# EAGLE design MiKro-1_0-Rev-A (EAGLE 6.4)
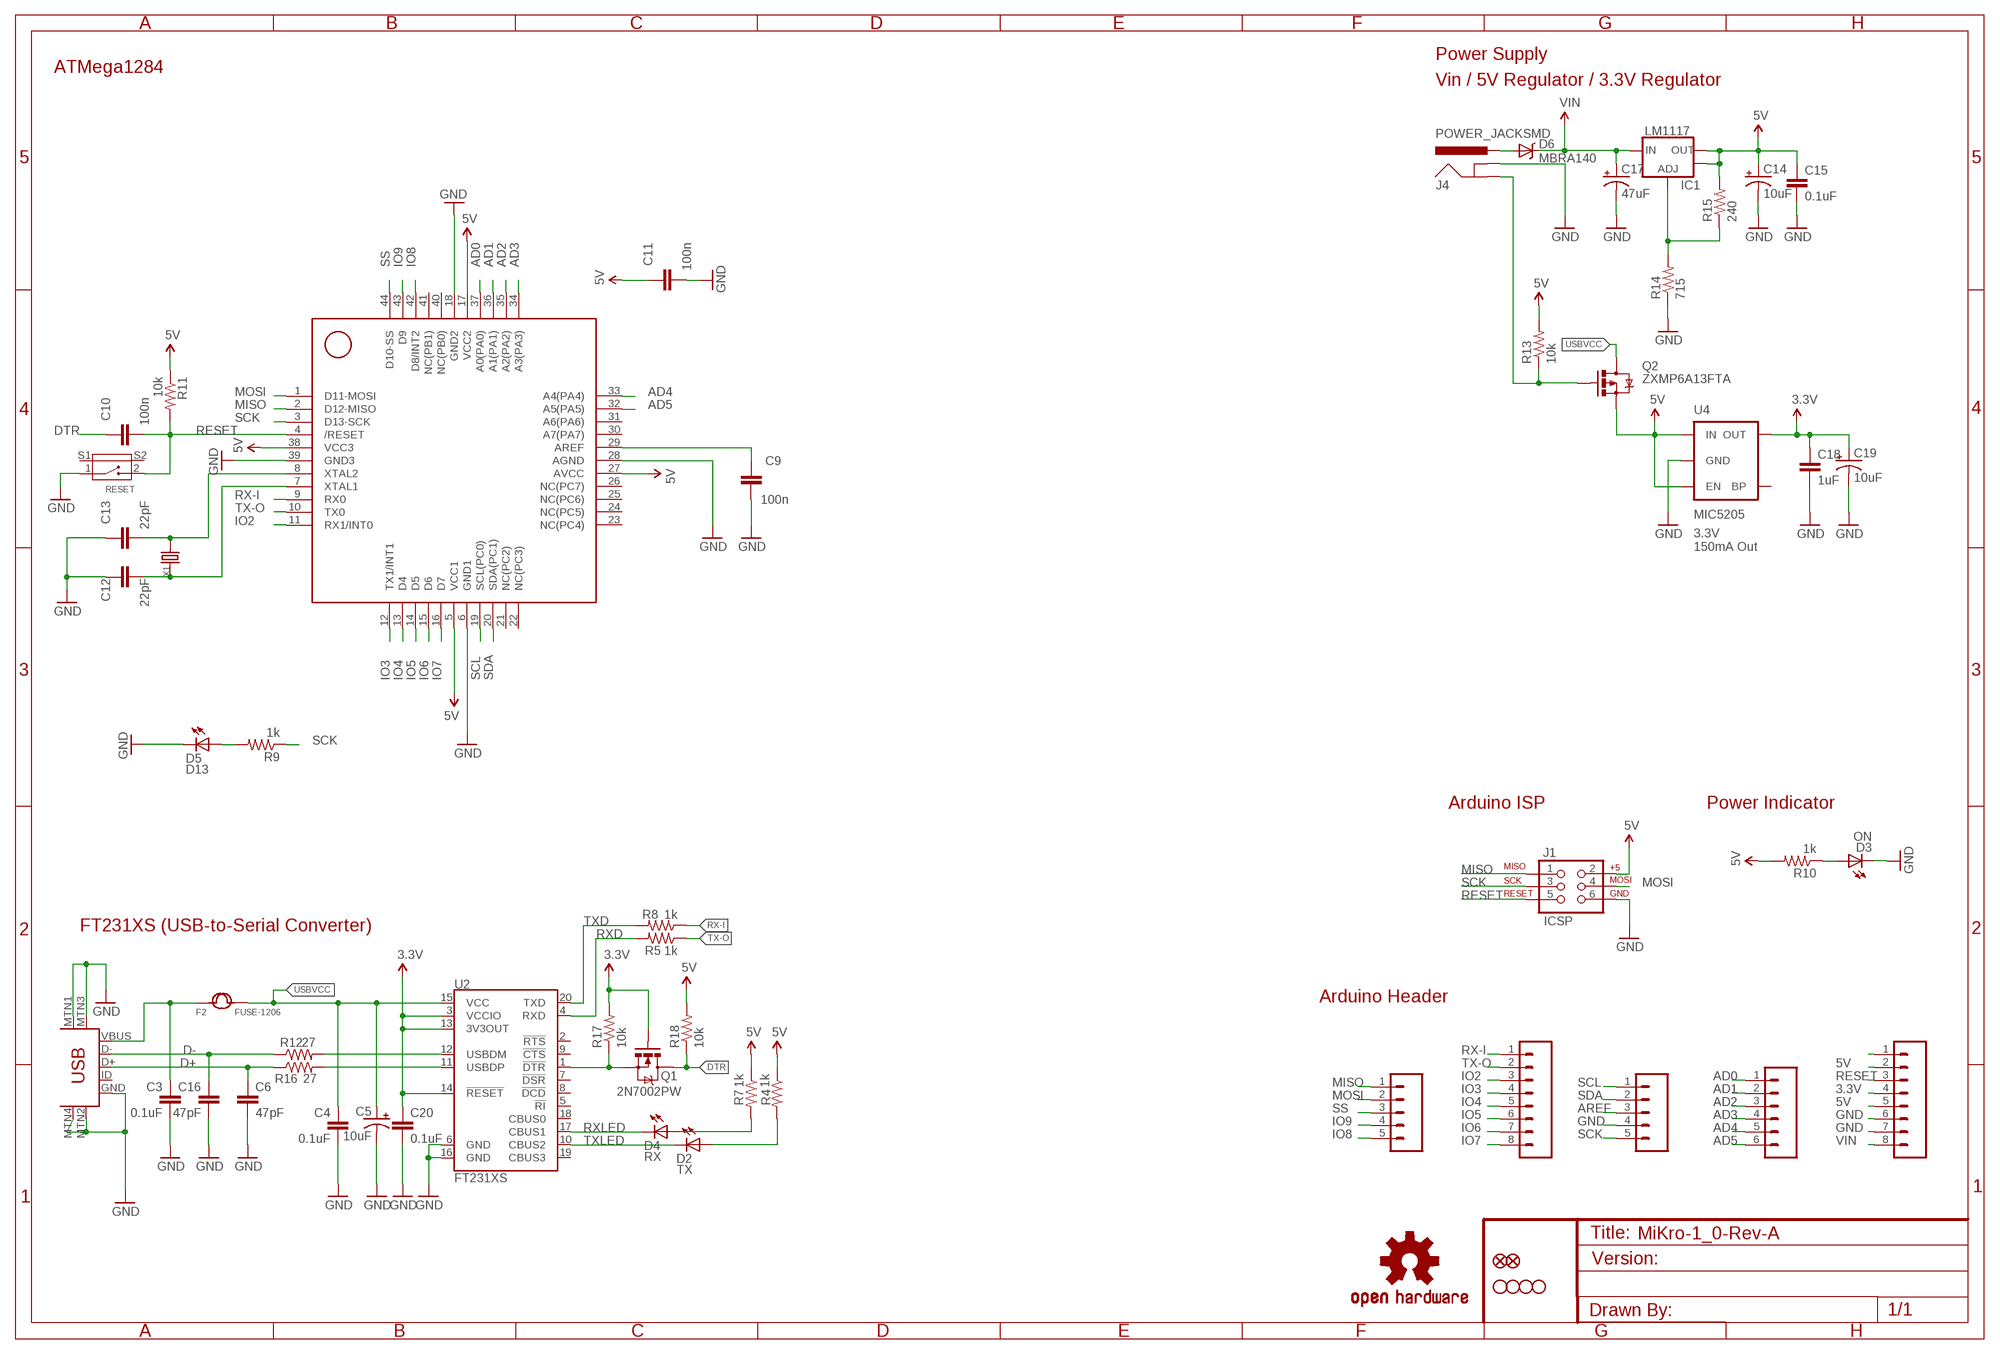
[diagram p0: schematic, sheet 1]

## Parts
C3  0.1uF  CAP0603-CAP  [0603-CAP]
C4  0.1uF  CAP0603-CAP  [0603-CAP]
C5  10uF  CAP_POL1206  [EIA3216]
C6  47pF  47PF-50V-5%(0603)  [0603-CAP]
C9  100n  CAP0603-CAP  [0603-CAP]
C10  100n  CAP0603-CAP  [0603-CAP]
C11  100n  CAP0603-CAP  [0603-CAP]
C12  22pF  CAP0603-CAP  [0603-CAP]
C13  22pF  CAP0603-CAP  [0603-CAP]
C14  10uF  CAP_POL1206  [EIA3216]
C15  0.1uF  CAP0603-CAP  [0603-CAP]
C16  47pF  47PF-50V-5%(0603)  [0603-CAP]
C17  47uF  CAP_POLD  [PANASONIC_D]
C18  1uF  CAP0603-CAP  [0603-CAP]
C19  10uF  CAP_POL1206  [EIA3216]
C20  0.1uF  CAP0603-CAP  [0603-CAP]
D2  TX  LED0603  [LED-0603]
D3  ON  LED0603  [LED-0603]
D4  RX  LED0603  [LED-0603]
D5  D13  LED0603  [LED-0603]
D6  MBRA140  DIODE-SCHOTTKY_  [SMA-DIODE]
F2  FUSE-1206  [F1206]
IC1  LM1117  V_REG_LM1117ALT1  [SOT223-ALT1]
J1  ICSP  AVR_SPI_PRG_6PTH  [2X3]
J4  POWER_JACKSMD  [POWER_JACK_SMD]
JP1  M08LONGPADS  [1X08_LONGPADS]
JP3  STAND-OFF  [STAND-OFF]
JP4  STAND-OFF  [STAND-OFF]
JP5  STAND-OFF  [STAND-OFF]
JP6  STAND-OFF  [STAND-OFF]
JP7  M08LONGPADS  [1X08_LONGPADS]
JP8  FIDUCIAL1X2  [FIDUCIAL-1X2]
JP9  FIDUCIAL1X2  [FIDUCIAL-1X2]
JP11  M06LONGPADS  [1X06_LONGPADS]
JP12  M05PTH_LONGPADS  [1X05_LONGPADS]
JP13  M05PTH_LONGPADS  [1X05_LONGPADS]
LOGO1  OSHW-LOGOM  [OSHW-LOGO-M]
Q1  2N7002PW  MOSFET-NCHANNEL2N7002PW  [SOT323]
Q2  ZXMP6A13FTA  MOSFET-PCHANNELSMD  [SOT23-3]
R4  1k  RESISTOR0603-RES  [0603-RES]
R5  1k  RESISTOR0603-RES  [0603-RES]
R7  1k  RESISTOR0603-RES  [0603-RES]
R8  1k  RESISTOR0603-RES  [0603-RES]
R9  1k  RESISTOR0603-RES  [0603-RES]
R10  1k  RESISTOR0603-RES  [0603-RES]
R11  10k  RESISTOR0603-RES  [0603-RES]
R12  27  RESISTOR0603-RES  [0603-RES]
R13  10k  RESISTOR0603-RES  [0603-RES]
R14  715  RESISTOR0603-RES  [0603-RES]
R15  240  RESISTOR0603-RES  [0603-RES]
R16  27  RESISTOR0603-RES  [0603-RES]
R17  10k  RESISTOR0603-RES  [0603-RES]
R18  10k  RESISTOR0603-RES  [0603-RES]
RESET  BUTTON-2P-REINFORCE-3100060P1  [4P-SMD-7.0X3.5X3.5H-90D]
U2  FT231XS  [SSOP20_L]
U3  ATMEGA1284P  [TQFP44]
U4  MIC5205  V_REG_LDOSMD  [SOT23-5]
U$3  USB-MINIB-5PIN  [USB-MINIB]
X1  CRYSTAL-0500290P1  [2P-SMD-5.0X3.2]

## Nets
3.3V: C18.1 C19.A(+) C20.1 JP7.4 Q1.1(G) R17.2 U2.3(VCCIO) U2.13(3V3OUT) U2.14(!RESET) U4.5(OUT)
5V: C11.1 C14.A(+) C15.1 IC1.2(OUT) IC1.4(OUT) J1.2 JP7.2 JP7.5 Q2.2(S) R4.1 R7.1 R10.2 R11.1 R13.2 R15.2 R18.2 U3.5(VCC1) U3.17(VCC2) U3.27(AVCC) U3.38(VCC3) U4.1(IN) U4.3(EN)
AD0: JP11.1 U3.37(A0(PA0))
AD1: JP11.2 U3.36(A1(PA1))
AD2: JP11.3 U3.35(A2(PA2))
AD3: JP11.4 U3.34(A3(PA3))
AD4: JP11.5 U3.33(A4(PA4))
AD5: JP11.6 U3.32(A5(PA5))
AREF: JP12.3
D+: C6.1 R16.1 U$3.D+
D-: C16.1 R12.1 U$3.D-
DTR: C10.1 Q1.3(D) R18.1
GND: C3.2 C4.2 C5.C(-) C6.2 C9.2 C11.2 C12.1 C13.1 C14.C(-) C15.2 C16.2 C17.- C18.2 C19.C(-) C20.2 D3.C D5.C J1.6 J4.GND(GNDBREAK) JP7.6 JP7.7 JP12.4 R14.1 RESET.1 U2.6(GND) U2.16(GND) U3.6(GND1) U3.18(GND2) U3.28(AGND) U3.39(GND3) U4.2(GND) U$3.GND U$3.MTN1(MTN2) U$3.MTN2(MTN3) U$3.MTN3(MTN1) U$3.MTN4
INSERT: J4.P$4(GND) Q2.1(G) R13.1
IO2: JP1.3 U3.11(RX1/INT0)
IO3: JP1.4 U3.12(TX1/INT1)
IO4: JP1.5 U3.13(D4)
IO5: JP1.6 U3.14(D5)
IO6: JP1.7 U3.15(D6)
IO7: JP1.8 U3.16(D7)
IO8: JP13.5 U3.42(D8/INT2)
IO9: JP13.4 U3.43(D9)
MISO: J1.1 JP13.1 U3.2(D12-MISO)
MOSI: J1.4 JP13.2 U3.1(D11-MOSI)
N$2: D3.A R10.1
N$11: D5.A R9.2
N$14: C13.2 U3.8(XTAL2) X1.2
N$15: D2.A R4.2
N$16: C12.2 U3.7(XTAL1) X1.1
N$17: C9.1 U3.29(AREF)
N$18: JP7.1
N$20: D4.A R7.2
N$21: IC1.1(ADJ) R14.2 R15.1
N$22: R12.2 U2.12(USBDM)
N$23: R16.2 U2.11(USBDP)
N$24: Q1.2(S) R17.1 U2.1(!DTR)
PWRIN1: D6.A J4.VIN0(PWR)
RESET: C10.2 J1.5 JP7.3 R11.2 RESET.2 U3.4(/RESET)
RX-I: JP1.1 R8.1 U3.9(RX0)
RXD: R5.2 U2.4(RXD)
RXLED: D4.C U2.17(CBUS1)
SCK: J1.3 JP12.5 R9.1 U3.3(D13-SCK)
SCL: JP12.1 U3.19(SCL(PC0))
SDA: JP12.2 U3.20(SDA(PC1))
SS: JP13.3 U3.44(D10-SS)
TX-O: JP1.2 R5.1 U3.10(TX0)
TXD: R8.2 U2.20(TXD)
TXLED: D2.C U2.10(CBUS2)
USBVCC: C4.1 C5.A(+) F2.2 Q2.3(D) U2.15(VCC)
VIN: C17.+ D6.C IC1.3(IN) JP7.8
VUSB: C3.1 F2.1 U$3.VBUS
Unconnected: RESET.S1 RESET.S2 U2.2(!RTS) U2.5(!RI) U2.7(!DSR) U2.8(!DCD) U2.9(!CTS) U2.18(CBUS0) U2.19(CBUS3) U3.21(NC(PC2)) U3.22(NC(PC3)) U3.23(NC(PC4)) U3.24(NC(PC5)) U3.25(NC(PC6)) U3.26(NC(PC7)) U3.30(A7(PA7)) U3.31(A6(PA6)) U3.40(NC(PB0)) U3.41(NC(PB1)) U4.4(BP) U$3.ID

## Notes on the sheet
- Power Supply
- ATMega1284
- Vin / 5V Regulator / 3.3V Regulator
- 3.3V
  150mA Out
- Arduino ISP | Power Indicator
- FT231XS (USB-to-Serial Converter)
- Arduino Header

## Library data of the parts
C3 C4 C15 C18 C20 = SparkFun:CAP: Capacitor Standard 0603 ceramic capacitor, and 0.1" leaded capacitor.
C5 = SparkFun-Capacitors:CAP_POL: Capacitor Polarized These are standard SMD and PTH capacitors. Normally 10uF, 47uF, and 100uF in electrolytic and tantalum varieties. Always verify the external diameter of the through hole cap, it varies with capacity, voltage, and manufacturer. The EIA devices should be standard.
C6 C16 = SparkFun-Capacitors:47PF-50V-5%(0603): CAP-08913; PROD_ID: CAP-08913
C9-C13 = SparkFun-Capacitors:CAP: Capacitor Standard 0603 ceramic capacitor, and 0.1" leaded capacitor.
C14 C17 C19 = SparkFun:CAP_POL: Capacitor Polarized These are standard SMD and PTH capacitors. Normally 10uF, 47uF, and 100uF in electrolytic and tantalum varieties. Always verify the external diameter of the through hole cap, it varies with capacity, voltage, and manufacturer. The EIA devices should be standard.
D2-D5 = SparkFun:LED: LEDs Standard schematic elements and footprints for 5mm, 3mm, 1206, and 0603 sized LEDs. 5mm - Spark Fun Electronics SKU : COM-00529 (and others)
D6 = SparkFun:DIODE-SCHOTTKY
F2 = OPL Eagle Library:FUSE*
IC1 = Testing:V_REG_LM1117: Voltage Regulator LM1117 Standard adjustable voltage regulator but in SMD form. Spark Fun Electronics SKU : COM-00595
J1 = SparkFun:AVR_SPI_PRG_6: AVR ISP 6 Pin This is the reduced ISP connector for AVR programming. Common on Arduino. This footprint will take up less PCB space and can be used with a 10-pin to 6-pin adapter such as SKU: BOB-08508
J4 = SparkFun:POWER_JACK: Power Jack This is the standard 5.5mm barrel jack for power. The PTH is the most common, proven, reliable, footprint. All others are experimental. The Slot footprint only works if the mill layer is transmitted to the PCB fab house so be warned. Spark Fun Electronics SKU : PRT-00119. Mating wall wart : TOL-00298 (and others)
JP1 JP7 = SparkFun-Connectors:M08: Header 8 Standard 8-pin 0.1" header. Use with straight break away headers (SKU : PRT-00116), right angle break away headers (PRT-00553), swiss pins (PRT-00743), machine pins (PRT-00117), and female headers (PRT-00115).
JP3-JP6 = SparkFun:STAND-OFF: Stand Off This is the mechanical footprint for a #4 phillips button head screw. Use the keepout ring to avoid running the screw head into surrounding components. SKU : PRT-00447
JP8 JP9 = SparkFun:FIDUCIAL: Fiducial Alignment Points Various fiducial points for machine vision alignment.
JP11 = SparkFun-Connectors:M06: Header 6 Standard 6-pin 0.1" header. Use with straight break away headers (SKU : PRT-00116), right angle break away headers (PRT-00553), swiss pins (PRT-00743), machine pins (PRT-00117), and female headers (PRT-00115). Molex polarized connector foot print use with SKU : PRT-08094 with associated crimp pins and housings. NOTES ON THE VARIANTS LOCK and LOCK_LONGPADS... This footprint was designed to help hold the alignment of a through-hole component (i.e. 6-pin header) while soldering it into place. You may notice that each hole has been shifted either up or down by 0.005 of an inch from it's more standard position (which is a perfectly straight line). This slight alteration caused the pins (the squares in the middle) to touch the edges of the holes. Because they are alternating, it causes a "brace" to hold the component in place. 0.005 has proven to be the perfect amount of "off-center" position when using our standard breakaway headers. Although looks a little odd when you look at the bare footprint, once you have a header in there, the alteration is very hard to notice. Also, if you push a header all the way into place, it is covered up entirely on the bottom side. This idea of altering the position of holes to aid alignment will be further integrated into the Sparkfun Library for other footprints. It can help hold any component with 3 or more connection pins.
JP12 JP13 = SparkFun-Connectors:M05: Header 5 Standard 5-pin 0.1" header. Use with straight break away headers (SKU : PRT-00116), right angle break away headers (PRT-00553), swiss pins (PRT-00743), machine pins (PRT-00117), and female headers (PRT-00115). Molex polarized connector foot print use with SKU : PRT-08230 with associated crimp pins and housings.
LOGO1 = SparkFun-Aesthetics:OSHW-LOGO: Open Source Hardware Logo This logo indicates the piece of hardware it is found on incorporates a OSHW license and/or adheres to the definition of open source hardware found here: http://freedomdefined.org/OSHW
Q1 = SparkFun-DiscreteSemi:MOSFET-NCHANNEL: Common NMOSFET Parts MFG P/N Store ID Prod ID FDD8780 TRANS-09984 SI7820DN TRANS-11055 FDS6630A IC-08089 2N7002PW TRANS-11151 FQP30N06L COM-10213 TRANS-10060 BSS123LT1G TRANS-08345 BSS138 TRANS-00830 BS170 2N7000; PROD_ID: TRANS-11151
Q2 = SparkFun:MOSFET-PCHANNEL
R4 R5 R7 R8 R13-R15 R17 R18 = SparkFun:RESISTOR: Resistor Basic schematic elements and footprints for 0603, 1206, and PTH resistors.
R9-R12 R16 = SparkFun-Resistors:RESISTOR: Resistor Basic schematic elements and footprints for 0603, 1206, and PTH resistors.
RESET = OPL Eagle Library:BUTTON-2P-REINFORCE: TS-1188E http://www.best-dz.com/?thread-374-2.html SMD Button
U2 = SparkFun-DigitalIC:FT231X: FTDI FT231X Full Speed USB to Full-handshake UART This USB2.0 Full Speed IC offers a compact bridge to full handshake UART interfaces. The device is a UART, capable of operating up to 3MBaud, with low power consumption (8mA). The FT231X includes the complete FT-X series feature set and enables USB to be added into a system design quickly and easily over a UART interface.
U3 = K-Duino:ATMEGA1284P
U4 = SparkFun:V_REG_LDO: Voltage Regulator LDO Standard 150mA LDO voltage regulator in SOT-23 layout. Micrel part MIC5205. BP (by-pass) pin is used to lower output noise with 470pF cap.
U$3 = SparkFun-Connectors:USB-MINIB: Mini-USB "B" connector with 5th pin broken out. Created new symbol breaking out 5th "ID" pin in mini/micro USB connector spec. See: http://en.wikipedia.org/wiki/Mini_usb#Cables. Uses same footprint as 4-pin symbol. Also added pins to connect to mounting / shield pads if required (probably not generally needed as signals aren't shielded once they leave the connector).
X1 = OPL Eagle Library:CRYSTAL*

## Net classes
0 default: width 0.152 mm, drill 0.305 mm, clearance 0.152 mm

## Board
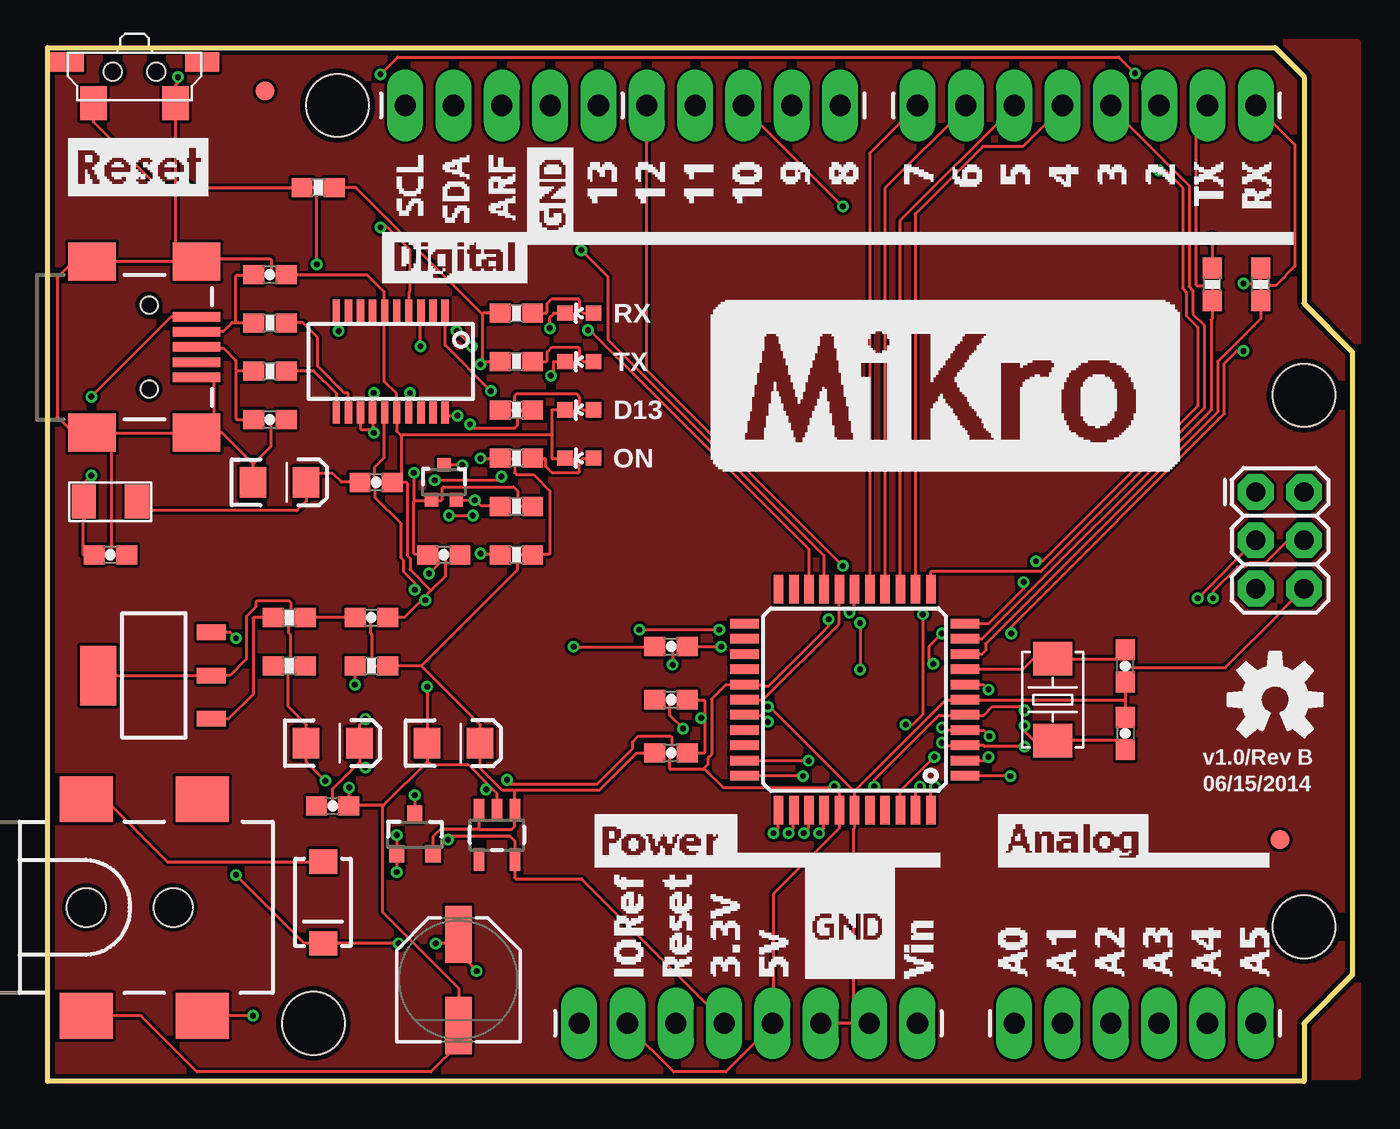
[diagram p1: board, top side]
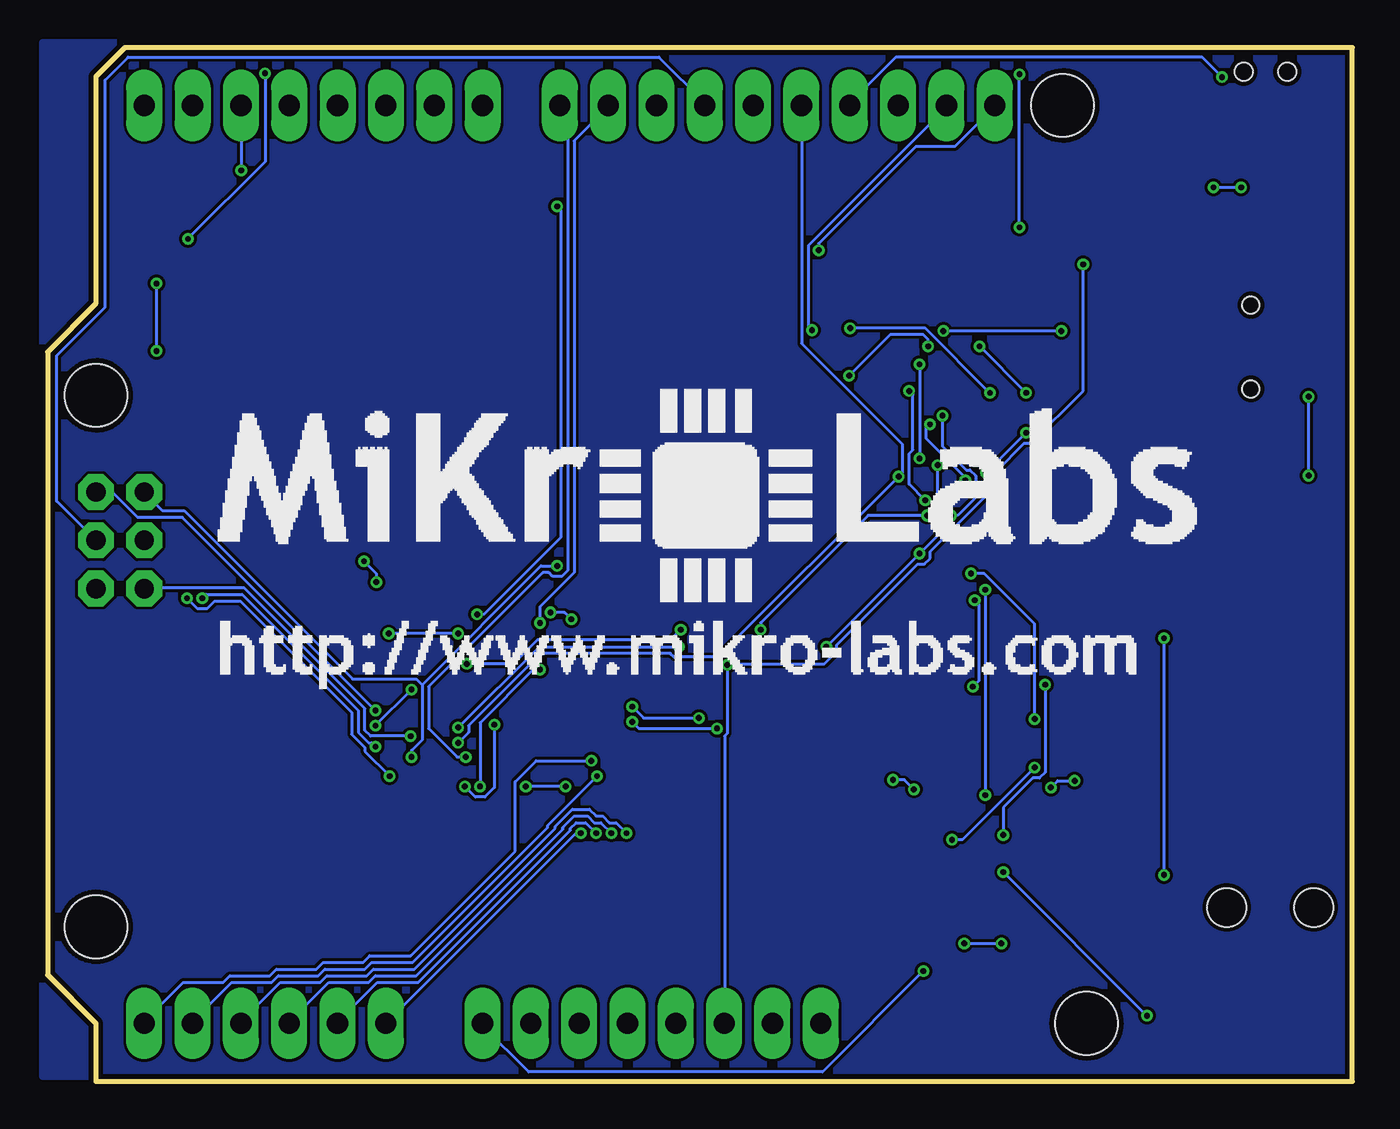
[diagram p2: board, bottom side, seen from below]

Size 68.58 x 54.36 mm. Coordinates in mm from the lower left corner, seen from the top.
Outline: 0,54.36 64.52,54.36 66.04,52.83 66.04,40.89 68.58,38.35 68.58,5.59 66.04,3.05 66.04,0 0,0 0,54.36
Copper layers (1*2*15*16): Top 0.035mm / dielectric 0.2mm / Route2 0.0175mm / dielectric 1.1mm / Route15 0.0175mm / dielectric 0.2mm / Bottom 0.035mm
Design rules "SeeedStudio_DRU_no_angle_20130527": minimum track width 6mil, minimum drill 12mil, track to track 6mil, track to pad 6mil, pad to pad 6mil, via to via 6mil, smd to smd 0mil, copper to edge 10mil, drill to drill 10mil, minimum pad ring 6mil, minimum via ring 6mil, stop-mask expansion 2mil, vias tented up to drill 25mil, thermal gap 10mil

### Footprints (pad centres in the part's own frame; a part is rotated, then mirrored left to right if it is on the bottom)
0603-CAP = smd 1.1 x 1: 1 -0.85,0; 2 0.85,0
EIA3216 = smd 1.4 x 1.6: A 1.4,0; C -1.4,0
PANASONIC_D = smd 3 x 1.4: + 2.4,0; - -2.4,0
LED-0603 = smd 0.8 x 0.8: A 0,-0.75; C 0,0.75
SMA-DIODE = smd 1.27 x 1.47: A -2.15,0; C 2.15,0
F1206 = smd 1.27 x 1.778: 1 -1.397,0; 2 1.397,0
SOT223-ALT1 = smd 0.813 x 1.524: 1 -2.271,-3.02; 2 0,-3.02; 3 2.288,-3.02 | smd 3.124 x 1.905: 4 0,2.921
2X3 = drill 1.016 pad 1.88 octagon: 1 0,0; 2 0,2.54; 3 2.54,0; 4 2.54,2.54; 5 5.08,0; 6 5.08,2.54
POWER_JACK_SMD = smd 2.8 x 2.4: GND 0,-5.7; P$4 6.1,-5.7; VIN0 0,5.7; VIN1 6.1,5.7 | hole 2.032: 0,0; 4.572,0
1X08_LONGPADS = drill 1.118 pad 1.88 long: 1 0,0; 2 2.54,0; 3 5.08,0; 4 7.62,0; 5 10.16,0; 6 12.7,0; 7 15.24,0; 8 17.78,0
STAND-OFF = hole 3.302: 0,0
FIDUCIAL-1X2 = smd 1 x 1: 1 0,0
1X06_LONGPADS = drill 1.118 pad 1.88 long: 1 0,0; 2 2.54,0; 3 5.08,0; 4 7.62,0; 5 10.16,0; 6 12.7,0
1X05_LONGPADS = drill 1.118 pad 1.88 long: 1 0,0; 2 2.54,0; 3 5.08,0; 4 7.62,0; 5 10.16,0
SOT323 = smd 0.7 x 0.7: 1 -0.65,-0.925; 2 0.65,-0.925; 3 0,0.925
SOT23-3 = smd 0.8 x 0.9: 1 -0.95,-1; 2 0.95,-1; 3 0,1.1
0603-RES = smd 1.1 x 1: 1 -0.85,0; 2 0.85,0
4P-SMD-7.0X3.5X3.5H-90D = smd 1.397 x 1.778: 1 -2.159,1.651; 2 2.159,1.651 | smd 1.778 x 1.016: S1 -3.556,-0.508; S2 3.556,-0.508 | hole 0.95: -1.15,0; 1.15,0
SSOP20_L = smd 0.381 x 1.143: 1 -2.857,-2.68; 2 -2.223,-2.68; 3 -1.587,-2.68; 4 -0.953,-2.68; 5 -0.318,-2.68; 6 0.318,-2.68; 7 0.953,-2.68; 8 1.587,-2.68; 9 2.223,-2.68; 10 2.857,-2.68; 11 2.857,2.68; 12 2.223,2.68; 13 1.587,2.68; 14 0.953,2.68; 15 0.318,2.68; 16 -0.318,2.68; 17 -0.953,2.68; 18 -1.587,2.68; 19 -2.223,2.68; 20 -2.857,2.68
TQFP44 = smd 1.5 x 0.5: 1 -5.8,4; 2 -5.8,3.2; 3 -5.8,2.4; 4 -5.8,1.6; 5 -5.8,0.8; 6 -5.8,0; 7 -5.8,-0.8; 8 -5.8,-1.6; 9 -5.8,-2.4; 10 -5.8,-3.2; 11 -5.8,-4; 23 5.8,-4; 24 5.8,-3.2; 25 5.8,-2.4; 26 5.8,-1.6; 27 5.8,-0.8; 28 5.8,0; 29 5.8,0.8; 30 5.8,1.6; 31 5.8,2.4; 32 5.8,3.2; 33 5.8,4 | smd 0.5 x 1.5: 12 -4,-5.8; 13 -3.2,-5.8; 14 -2.4,-5.8; 15 -1.6,-5.8; 16 -0.8,-5.8; 17 0,-5.8; 18 0.8,-5.8; 19 1.6,-5.8; 20 2.4,-5.8; 21 3.2,-5.8; 22 4,-5.8; 34 4,5.8; 35 3.2,5.8; 36 2.4,5.8; 37 1.6,5.8; 38 0.8,5.8; 39 0,5.8; 40 -0.8,5.8; 41 -1.6,5.8; 42 -2.4,5.8; 43 -3.2,5.8; 44 -4,5.8
SOT23-5 = smd 0.55 x 1.2: 1 -0.95,-1.3; 2 0,-1.3; 3 0.95,-1.3; 4 0.95,1.3; 5 -0.95,1.3
USB-MINIB = smd 2.5 x 0.5: D+ 2.5,0; D- 2.5,0.8; GND 2.5,-1.6; ID 2.5,-0.8; VBUS 2.5,1.6 | smd 2.5 x 2: MTN1 -3,4.5; MTN2 2.5,4.5; MTN3 -3,-4.5; MTN4 2.5,-4.5 | hole 0.9: 0,2.2; 0,-2.2
2P-SMD-5.0X3.2 = smd 1.778 x 2.032: 1 -2.159,0; 2 2.159,0

### Placement (x,y rotation side)
C3  3.3,27.69 0 top
C4  17.27,31.5 0 top
C5  12.19,31.5 0 top
C6  11.68,34.8 0 top
C9  32.77,20.07 0 top
C10  32.77,22.86 0 top
C11  32.77,17.27 0 top
C12  56.64,18.29 270 top
C13  56.64,21.84 90 top
C14  21.34,17.78 0 top
C15  17.02,24.38 0 top
C16  11.68,42.42 0 top
C17  21.59,5.33 90 top
C18  14.99,14.48 0 top
C19  14.99,17.78 0 top
C20  20.83,27.69 0 top
D2  27.94,37.85 90 top
D3  27.94,32.77 90 top
D4  27.94,40.39 90 top
D5  27.94,35.31 90 top
D6  14.48,9.4 270 top
F2  3.3,30.48 0 top
IC1  5.59,21.34 90 top
J1  63.5,30.99 270 top
J4  2.03,9.14 0 top
JP1  63.5,51.31 180 top
JP3  13.97,3.05 0 top
JP4  66.04,8.13 0 top
JP5  66.04,36.07 0 top
JP6  15.24,51.31 0 top
JP7  27.94,3.05 0 top
JP8  64.77,12.7 0 top
JP9  11.43,52.07 0 top
JP11  50.8,3.05 0 top
JP12  18.8,51.31 0 top
JP13  31.5,51.31 0 top
LOGO1  64.52,20.07 0 top
Q1  20.83,31.5 0 top
Q2  19.3,12.95 0 top
R4  24.64,37.85 0 top
R5  61.21,41.91 90 top
R7  24.64,40.39 0 top
R8  63.75,41.91 90 top
R9  24.64,35.31 180 top
R10  24.64,32.77 180 top
R11  14.22,46.99 180 top
R12  11.68,39.88 0 top
R13  17.02,21.84 0 top
R14  12.7,21.84 0 top
R15  12.7,24.38 0 top
R16  11.68,37.34 0 top
R17  24.64,30.23 0 top
R18  24.64,27.69 0 top
RESET  4.57,53.09 180 top
U2  18.03,37.85 180 top
U3  42.42,20.07 180 top
U4  23.62,12.95 180 top
U$3  5.33,38.61 0 top
U$16  [POWER-ANALOG]  28.45,1.78 0 top
U$17  [DIGITAL]  17.53,41.91 0 top
U$19  [MIKROLABS-LOGO-LARGE]  62.23,23.37 0 bottom
U$20  [MIKROLABS-URL]  60.71,19.56 0 bottom
U$21  [RESET]  1.02,46.48 0 top
U$22  [MIKRO]  34.54,31.75 0 top
X1  52.83,20.07 90 top

### Tracks (layer width: path | path; a pad name or v marks a point on that pad's centre or on a via)
3.3V  (via drill 0.3)
  Top 0.152: 19.3,30.55 20.15,30.55 Q1.1 20.25,30.55 20.7,30.55 20.75,30.6 20.75,31.2 20.8,31.25 24.5,31.25 24.7,31.05 24.7,30.35 24.8,30.25 25.45,30.25 R17.2 | 19.3,30.55 19.25,30.5 19.25,27.75 19.3,27.7 19.95,27.7 C20.1 20.05,27.7 20.55,27.7 20.55,27.2 v20.05,26.7 | 17.05,34.25 16.5,34.25 16.45,34.3 16.45,35.15 U2.13 | 17.05,34.25 17.1,34.3 17.1,35.15 U2.14 17.1,35.2 17.1,36.15 v17.15,36.2 | v19.6,38.65 19.6,40.5 U2.3 | v19.25,32 19.25,30.6 19.3,30.55 | v17.15,34.1 17.05,34.2 17.05,34.25 | 16.4,16.8 14.95,15.35 14.95,14.65 14.8,14.5 14.15,14.5 C18.1 | 16.4,16.8 16.4,17.75 C19.A 16.4,17.85 16.4,18.75 v16.7,19.05 | v21.05,12.7 21.25,12.9 24.3,12.9 24.55,12.65 24.55,11.7 U4.5 24.55,11.6 24.55,10.7 24.6,10.65 28.05,10.65 35.55,3.15 JP7.4 | 16.4,16.8 v16.7,16.5
  Bottom 0.152: v17.15,36.2 v19.6,38.65 | v17.15,34.1 v19.25,32 | v21.05,12.7 20.5,12.7 v16.7,16.5 | v20.05,26.7 19.35,26.7 16.7,24.05 v16.7,19.05
5V  (via drill 0.3)
  Top 0.152: 22.9,37.85 23.75,37.85 R4.1 | 22.9,37.85 22.85,37.9 22.85,40.35 | 22.85,40.35 22.9,40.4 23.75,40.4 R7.1 | 22.85,40.35 16.2,47 15.1,47 R11.1 | v22.75,32.75 23.75,32.75 R10.2 23.8,32.75 24.5,32.75 24.55,32.7 24.55,32 24.65,31.9 25.55,31.9 26.4,31.05 26.4,27.75 26.35,27.7 R18.2 25.45,27.7 24.8,27.7 24.7,27.6 24.7,26.9 19.65,21.85 | 22.9,37.85 v22.75,37.7 | IC1.4 2.7,21.35 IC1.2 8.65,21.35 9.6,21.35 10.45,22.2 10.45,24.45 10.95,24.95 10.95,25.2 11,25.25 12.7,25.25 12.8,25.15 12.8,24.65 13.05,24.4 13.5,24.4 R15.2 13.55,24.4 16.15,24.4 C15.1 16.2,24.4 16.9,24.4 16.95,24.35 16.95,23.6 17.05,23.5 17.05,22 17.2,21.85 17.85,21.85 R13.2 17.95,21.85 19.65,21.85 | 22.65,13.3 22.6,13.25 20.65,13.25 20.25,12.85 20.25,12 Q2.2 | 22.65,13.3 22.65,14.25 U4.3 | 22.65,13.3 22.7,13.25 24.4,13.25 24.55,13.4 24.55,14.25 U4.1 24.55,14.3 24.55,15.25 | 24.55,15.25 24.5,15.3 23.9,15.3 22.75,16.45 22.75,17.75 C14.A 22.75,17.85 22.75,18.75 19.65,21.85 | JP7.2 30.5,3 30.5,2.9 32.9,0.5 35.65,0.5 38.1,2.95 JP7.5 38.15,3.1 38.15,9.85 41.6,13.3 41.6,14.2 U3.38 41.6,14.3 41.6,15.15 41.3,15.45 | 34.5,16.45 34.7,16.65 34.7,17 34.9,17.2 34.9,20.1 35.65,20.85 36.6,20.85 U3.27 36.65,20.85 37.6,20.85 37.65,20.8 37.9,20.8 41.05,23.95 v41.05,24.3 | 34.5,16.45 34.45,16.4 32.75,16.4 32.7,16.45 32.7,17.15 32.6,17.25 31.95,17.25 C11.1 31.85,17.25 30.95,17.25 29,15.3 24.6,15.3 24.55,15.25 | 41.3,15.45 35.5,15.45 34.5,16.45 | v43.45,15.5 43.45,15.85 46.85,19.25 48.2,19.25 U3.5 48.25,19.25 49.2,19.25 49.65,19.7 51.15,19.7 v51.35,19.5 | v41.35,15.5 41.3,15.45 | v42.15,24.65 42.4,24.9 42.4,25.85 U3.17
  Bottom 0.152: v22.75,37.7 v22.75,32.75 | v41.35,15.5 v43.45,15.5 | v42.15,24.65 41.4,24.65 v41.05,24.3 | v51.35,19.5 61.5,29.65 63.85,29.65 65.15,30.95 66,30.95 J1.2
AD0  (via drill 0.3)
  Top 0.152: v40.55,13.05 40.8,13.3 40.8,14.25 U3.37
  Bottom 0.152: v40.55,13.05 40.8,13.05 JP11.1
AD1  (via drill 0.3)
  Top 0.152: v39.75,13.05 40,13.3 40,14.25 U3.36
  Bottom 0.152: v39.75,13.05 40.3,13.6 40.8,13.6 41.1,13.3 41.1,13.2 49.1,5.2 51.25,5.2 53.3,3.15 53.3,3.05 JP11.2
AD2  (via drill 0.3)
  Top 0.152: v38.95,13.05 39.2,13.3 39.2,14.25 U3.35
  Bottom 0.152: v38.95,13.05 39.5,13.6 39.85,13.6 40.2,13.95 40.9,13.95 41.5,13.35 41.5,13.25 49.2,5.55 51.35,5.55 51.7,5.2 53.8,5.2 55.85,3.15 55.85,3.05 JP11.3
AD3  (via drill 0.3)
  Top 0.152: v38.15,13.05 38.4,13.3 38.4,14.25 U3.34
  Bottom 0.152: v38.15,13.05 38.7,13.6 39.05,13.6 39.4,13.95 39.75,13.95 40.1,14.3 41,14.3 41.9,13.4 41.9,13.3 49.3,5.9 51.45,5.9 51.8,5.55 53.9,5.55 54.25,5.2 56.35,5.2 58.4,3.15 58.4,3.05 JP11.4
AD4  (via drill 0.3)
  Top 0.152: v39.7,16.05 36.65,16.05 U3.33
  Bottom 0.152: v39.7,16.05 42.3,13.45 42.3,13.35 49.4,6.25 51.55,6.25 51.9,5.9 54,5.9 54.35,5.55 56.45,5.55 56.8,5.2 58.9,5.2 60.95,3.15 JP11.5
AD5  (via drill 0.3)
  Top 0.152: v40,16.85 36.65,16.85 U3.32
  Bottom 0.152: v40,16.85 42.9,16.85 44,15.75 44,12.1 49.5,6.6 51.65,6.6 52,6.25 54.1,6.25 54.45,5.9 56.55,5.9 56.9,5.55 59,5.55 59.35,5.2 61.45,5.2 63.5,3.15 JP11.6
D+
  Top 0.152: 9.95,37.35 9.9,37.3 9.9,34.85 9.95,34.8 10.8,34.8 C6.1 | 9.95,37.35 10.8,37.35 R16.1 | 9.95,37.35 9.9,37.4 9.9,37.9 9.25,38.55 8.85,38.55 8.8,38.6 7.85,38.6 U$3.D+
D-
  Top 0.152: 9.9,39.9 9.7,39.9 9.25,39.45 8.85,39.45 8.8,39.4 7.85,39.4 U$3.D- | 9.9,39.9 10.8,39.9 R12.1 | 9.9,39.9 9.9,42.35 9.95,42.4 10.8,42.4 C16.1
DTR  (via drill 0.3)
  Top 0.152: v21.8,32.4 20.85,32.4 Q1.3 | v22.75,27.75 22.8,27.7 23.75,27.7 R18.1 | v27.65,22.85 31.9,22.85 C10.1
  Bottom 0.152: v21.8,32.4 21.8,28.7 v22.75,27.75 v27.65,22.85
GND  (via drill 0.3)
  Top 0.152: JP7.6 43.15,3.05 JP7.7 42.35,3.1 42.35,13.25 42.4,13.3 42.4,14.2 U3.39 42.4,14.3 42.4,15.25 | 34.55,19.1 34.55,20 34.5,20.05 33.65,20.05 C9.2 | 34.55,19.1 34.55,17.3 34.5,17.25 33.65,17.25 C11.2 33.55,17.25 33.05,17.25 32.8,17.5 32.8,18.1 32.75,18.15 31.05,18.15 30.75,17.85 30.75,17.5 28.9,15.65 24.35,15.65 v24.15,15.85 | 56.65,20.05 56.65,20.95 C13.1 56.65,21.05 56.65,21.7 56.7,21.75 61.9,21.75 64.8,24.65 64.8,24.7 66,25.9 J1.6 | 56.65,20.05 C12.1 | 37.6,20.05 37.9,19.75 | 37.9,19.75 42.4,15.25 | 37.6,20.05 36.65,20.05 U3.28 | 42.4,15.25 47.2,20.05 48.2,20.05 U3.6 48.25,20.05 56.65,20.05 | 37.6,20.05 41.6,24.05 41.6,25.85 U3.18 | v34.35,19.1 34.55,19.1 | v37.85,19.7 37.9,19.75 | C3.2 3.5,27.7 3.35,27.85 3.35,34.05 3.3,34.1 2.35,34.1 U$3.MTN3 | 10.8,32.45 11.75,33.4 11.75,34.7 11.85,34.8 12.5,34.8 C6.2 | 10.8,32.45 C5.C | 10.8,32.45 9.15,34.1 7.85,34.1 U$3.MTN4 | U$3.GND 7.85,37 8.7,37 8.75,36.95 8.75,34.15 U$3.MTN4 | U$3.MTN3 3.4,34.05 6.8,34.05 6.85,34.1 7.8,34.1 U$3.MTN4 | U$3.MTN2 7.85,43.1 8.8,43.1 8.95,43.25 11.7,43.25 11.75,43.2 11.75,42.5 11.85,42.4 12.5,42.4 C16.2 12.6,42.4 16.8,42.4 17.7,41.5 17.7,40.6 U2.6 17.7,40.5 17.7,36.8 18.35,36.15 18.35,35.2 U2.16 18.35,35.15 18.35,34.2 18.6,33.95 | U$3.MTN2 7.8,43.1 6.85,43.1 6.75,43.2 6.75,51.4 RESET.1 6.75,51.5 6.75,52.4 6.85,52.5 v6.85,52.8 | U$3.MTN2 6.75,43.1 2.35,43.1 U$3.MTN1 2.3,43.1 1.35,43.1 0.5,42.25 0.5,34.95 1.35,34.1 2.3,34.1 U$3.MTN3 | J4.GND 2.05,3.45 4.9,3.45 7.85,0.5 20.15,0.5 21.6,1.95 21.6,2.9 C17.- 21.6,3 21.6,4.9 17.6,8.9 17.6,14.5 | R14.1 12.5,21.85 12.65,21.7 12.65,19.7 13.6,18.75 13.6,17.8 C19.C 13.6,17.75 13.6,16.8 v14.6,15.8
  Top 0.152: 17.6,14.5 17.65,14.5 19.95,16.8 | 17.6,14.5 15.85,14.5 C18.2 15.85,14.55 v15.85,15.45 | 19.95,16.8 19.95,17.75 C14.C 19.95,17.85 v19.95,20.75 | 23.23,15.53 22.1,16.65 20.1,16.65 19.95,16.8 | 23.23,15.53 23.6,15.15 23.6,14.3 U4.2 | 20.15,25.8 20.9,26.55 20.9,27.65 20.95,27.7 21.65,27.7 C20.2 | 20.15,25.8 19.75,25.4 | 19.75,25.4 18.75,24.4 17.9,24.4 C15.2 | 26.5,34 26.5,35.3 27.15,35.3 D5.C | 26.5,34 26.5,32.75 27.15,32.75 D3.C | 18.6,33.95 18.6,31.5 18.15,31.5 C4.2 18.65,31.5 18.85,31.5 18.9,31.45 18.9,27.65 19.05,27.5 19.05,26.9 20.15,25.8 | 26.5,34 18.65,34 18.6,33.95 | v19.85,25.3 19.75,25.4 | 23.23,15.53 v23.05,15.35
  Bottom 0.152: v34.35,19.1 37.25,19.1 v37.85,19.7 | v6.85,52.8 7.9,53.85 24,53.85 26.4,51.45 26.4,51.35 JP12.4 | v14.6,15.8 15.5,15.8 v15.85,15.45 | v19.95,20.75 19.65,21.05 19.65,25.1 v19.85,25.3 | v24.15,15.85 23.55,15.85 v23.05,15.35
INSERT  (via drill 0.3)
  Top 0.152: v18.35,12.95 18.35,12 Q2.1 18.35,11.9 v18.35,11 | v16.15,20.85 16.15,21.8 R13.1 | v10.8,3.45 8.15,3.45 J4.P$4
  Bottom 0.152: v18.35,12.95 18.35,14.4 16.8,15.95 16.45,15.95 16.15,16.25 v16.15,20.85 | v18.35,11 v10.8,3.45
IO2  (via drill 0.3)
  Top 0.152: v51.3,26.25 51.3,25.9 49.45,24.05 48.25,24.05 U3.11 | v51.95,27.35 52.3,27.35 60.45,35.5 60.45,39.65 59.85,40.25 59.85,41.5 59.65,41.7 59.65,47 58.75,47.9 v58.4,47.9
  Bottom 0.152: v51.3,26.25 51.3,26.7 v51.95,27.35 | v58.4,47.9 58.4,51.3 JP1.3
IO3
  Top 0.152: U3.12 46.4,25.9 46.4,26.75 46.45,26.8 52.2,26.8 60.8,35.4 60.8,39.75 60.2,40.35 60.2,41.6 60,41.8 60,47.1 55.9,51.2 55.9,51.3 JP1.4
IO4
  Top 0.152: U3.13 45.6,25.9 45.6,45.6 49.15,49.15 51.25,49.15 53.3,51.2 53.3,51.3 JP1.5
IO5
  Top 0.152: JP1.6 50.8,51.25 44.8,45.25 44.8,25.9 U3.14
IO6
  Top 0.152: U3.15 44,25.9 44,46.95 48.25,51.2 JP1.7
IO7
  Top 0.152: U3.16 43.2,25.9 43.2,48.8 45.7,51.3 JP1.8
IO8  (via drill 0.3)
  Top 0.152: v46.6,17.05 44.8,15.25 44.8,14.3 U3.42
  Bottom 0.152: v46.6,17.05 47.05,17.05 48.55,18.55 48.55,20.75 42.55,26.75 42.25,26.75 42.05,26.55 41.55,26.55 41.25,26.85 41.25,50.9 JP13.5
IO9  (via drill 0.3)
  Top 0.152: v45.85,15.5 45.6,15.25 45.6,14.3 U3.43 | v42.7,24.1 v42.7,21.65
  Bottom 0.152: v45.85,15.5 45.85,18.85 43.05,21.65 v42.7,21.65 | v42.7,24.1 42.7,24.95 40.9,26.75 40.9,49.45 39.15,51.2 39.15,51.3 JP13.4
MISO  (via drill 0.3)
  Top 0.152: v49.45,17.05 49.25,16.85 48.25,16.85 U3.2 | v41.8,27.1 31.5,37.4 JP13.1
  Bottom 0.152: v49.45,17.05 49.45,17.4 48.9,17.95 48.9,20.85 | 48.9,20.85 49.2,21.15 52.55,21.15 61.4,30 62.55,30 63.5,30.95 J1.1 | v41.8,27.1 42.65,27.1 48.9,20.85
MOSI  (via drill 0.3)
  Top 0.152: v50.6,16.05 48.25,16.05 U3.1 | v61.25,25.4 61.25,25.75 62.55,27.05 62.95,27.05 63.15,27.25 64,27.25 65.15,28.4 66,28.4 J1.4
  Bottom 0.152: v50.6,16.05 51.9,17.35 51.9,17.55 52.6,18.25 52.6,19.4 58.45,25.25 59.8,25.25 60.2,24.85 60.7,24.85 v61.25,25.4 | JP13.2 34.05,51.35 34.05,51.45 36.45,53.85 64.35,53.85 65.55,52.65 65.55,40.7 68.1,38.15 68.1,30.5 J1.4
N$2
  Top 0.152: D3.A 28.65,32.75 28.15,32.75 27.95,32.55 27.95,32.05 27.9,32 26.5,32 26.15,32.35 26.15,32.75 25.5,32.75 R10.1
N$10
  pour Top: -0.25,54.61 68.83,54.61 68.83,0.25 -0.25,0.25
N$11
  Top 0.152: D5.A 28.65,35.3 28.15,35.3 27.95,35.5 27.95,36 27.8,36.15 24.65,36.15 24.55,36.05 24.55,35.35 24.5,35.3 R9.2
N$14
  Top 0.152: C13.2 56.65,22.65 56.65,22.2 53.85,22.2 53.8,22.25 52.85,22.25 X1.2 52.8,22.25 51.85,22.25 51.25,21.65 48.25,21.65 U3.8
N$15
  Top 0.152: D2.A 28.65,37.85 28.15,37.85 27.95,38.05 27.95,38.55 27.9,38.6 26.5,38.6 26.25,38.35 26.25,37.9 26.2,37.85 R4.2
N$16  (via drill 0.3)
  Top 0.152: C12.2 56.65,17.95 53.85,17.95 53.8,17.9 52.85,17.9 X1.1 52.8,17.9 51.85,17.9 51.35,18.4 v51.35,18.7 | v49.45,20.6 49.2,20.85 48.25,20.85 U3.7
  Bottom 0.152: v51.35,18.7 v49.45,20.6
N$17  (via drill 0.3)
  Top 0.152: v33.4,18.55 32.7,19.25 32.7,19.95 32.6,20.05 31.95,20.05 C9.1 | v37.85,18.9 37.5,19.25 36.65,19.25 U3.29
  Bottom 0.152: v33.4,18.55 37.5,18.55 v37.85,18.9
N$19
  pour Bottom: -0.25,54.61 68.83,54.61 68.83,0.25 -0.25,0.25
N$20
  Top 0.152: D4.A 28.65,40.4 28.15,40.4 27.95,40.6 27.95,41.1 27.9,41.15 26.5,41.15 26.25,40.9 26.25,40.45 26.2,40.4 R7.2
N$21
  Top 0.152: R14.2 12.95,21.85 12.75,22.05 12.75,23.5 12.65,23.6 12.65,24.35 12.6,24.4 11.85,24.4 R15.1 11.8,24.4 10.85,24.4 10.8,24.35 10.8,20.35 9.5,19.05 8.65,19.05 IC1.1
N$22
  Top 0.152: R12.2 12.55,39.9 13.4,39.9 14.2,39.1 14.2,37.6 15.6,36.2 15.75,36.2 15.8,36.15 15.8,35.2 U2.12
N$23
  Top 0.152: R16.2 12.55,37.35 14,37.35 15.2,36.15 15.2,35.2 U2.11
N$24  (via drill 0.3)
  Top 0.152: Q1.2 21.5,30.55 v22.45,30.55 22.5,30.55 22.8,30.25 23.75,30.25 R17.1 | v23.3,36.3 20.9,38.7 20.9,40.5 U2.1
  Bottom 0.152: v23.3,36.3 23.1,36.1 23.1,33.2 23.3,33 23.3,31.4 v22.45,30.55
PWRIN1
  Top 0.152: D6.A 14.45,11.55 6.3,11.55 3,14.85 2.05,14.85 J4.VIN0
RESET  (via drill 0.3)
  Top 0.152: v7.3,47 13.35,47 R11.2 13.45,47 14.1,47 14.15,46.95 v14.15,42.95 | v5.85,47 2.4,50.45 2.4,51.4 RESET.2 | v35.4,22.85 33.65,22.85 C10.2 33.55,22.85 32.9,22.85 32.85,22.8 v32.85,21.9 | v47,18.6 47.1,18.6 47.25,18.45 48.2,18.45 U3.4 48.25,18.45 49.2,18.45 v49.5,18.15
  Bottom 0.152: v5.85,47 v7.3,47 | v35.4,22.85 42.75,22.85 v47,18.6 | JP7.3 33,3.05 33,18.15 32.85,18.3 v32.85,21.9 32.8,21.95 27.75,21.95 27.1,22.6 27.1,22.95 22.85,27.2 22.5,27.2 22.2,27.5 22.2,27.85 18.7,31.35 18.7,32.1 17.25,33.55 16.9,33.55 14.15,36.3 v14.15,42.95 | v49.5,18.15 51.6,18.15 51.9,18.45 51.9,19.6 58.25,25.95 63.5,25.95 J1.5
RX-I
  Top 0.152: JP1.1 65.55,49.25 65.55,42.85 64.55,41.85 63.85,41.85 63.75,41.75 63.75,41.1 R8.1 63.75,41 63.75,40.1 61.5,37.85 61.5,35.2 49.3,23 49.3,22.65 49.1,22.45 48.25,22.45 U3.9
RXD  (via drill 0.3)
  Top 0.152: v61.2,44.3 61.2,42.8 R5.2 | v57.15,53 56.3,53.85 18.4,53.85 v17.5,52.95 | v17.5,44.9 17.85,44.9 19.05,43.7 19.05,41.55 19,41.5 19,40.55 U2.4
  Bottom 0.152: v61.2,44.3 57.15,48.35 v57.15,53 | v17.5,44.9 v17.5,52.95
RXLED  (via drill 0.3)
  Top 0.152: v26.4,39.6 26.4,40.15 26.6,40.35 26.6,40.4 27.15,40.4 D4.C | v19.05,36.2 19,36.15 19,35.2 U2.17
  Bottom 0.152: v26.4,39.6 22.45,39.6 v19.05,36.2
SCK  (via drill 0.3)
  Top 0.152: v51.35,17.6 49.25,17.6 49.2,17.65 48.25,17.65 U3.3 48.15,17.65 47.15,17.65 v47,17.8 | v60.45,25.4 J1.3 | v22.2,34.55 22.4,34.35 24.55,34.35 24.7,34.5 24.7,35.05 24.9,35.25 24.9,35.3 25.45,35.3 R9.1 | v20.35,31.6 23.65,31.6 v23.85,31.8
  Bottom 0.152: v51.35,17.6 51.55,17.8 51.7,17.8 52.25,18.35 52.25,19.5 58.35,25.6 60.25,25.6 v60.45,25.4 | v22.2,34.55 22.4,34.35 22.4,33.8 20.35,31.75 v20.35,31.6 | JP12.5 28.95,38.8 23.65,33.5 23.65,32 v23.85,31.8 33.35,22.3 35.65,22.3 35.85,22.5 42.65,22.5 46.45,18.7 46.45,18.35 v47,17.8
SCL  (via drill 0.3)
  Top 0.152: v28.05,43.7 29.45,42.3 29.45,39 40.8,27.65 40.8,25.9 U3.19
  Bottom 0.152: v28.05,43.7 28.05,44.05 22.95,49.15 20.9,49.15 18.75,51.3 JP12.1
SDA  (via drill 0.3)
  Top 0.152: v28.4,39.5 28.5,39.5 40,28 40,25.9 U3.20
  Bottom 0.152: v28.4,39.5 28.6,39.7 28.6,43.95 21.35,51.2 JP12.2
SS  (via drill 0.3)
  Top 0.152: v46.65,15.5 46.4,15.25 46.4,14.3 U3.44 | v45.1,18.75 45.45,18.75 46,19.3 v46,24.55 | v41.8,46 36.6,51.2 36.6,51.3 JP13.3
  Bottom 0.152: v46.65,15.5 46.1,14.95 45.6,14.95 45.1,15.45 v45.1,18.75 | v46,24.55 45.65,24.55 41.6,28.6 41.6,45.8 v41.8,46
TX-O
  Top 0.152: JP1.2 60.35,50.7 60.35,41.9 60.4,41.85 61.1,41.85 61.2,41.75 61.2,41.1 R5.1 61.2,41 61.2,40.1 61.15,40.05 61.15,35.3 49.1,23.25 48.25,23.25 U3.10
TXD  (via drill 0.3)
  Top 0.152: v62.85,41.95 63.5,41.95 63.75,42.2 R8.2 | v62.85,38.4 62.5,38.4 61.85,37.75 61.85,35.1 50.65,23.9 v50.65,23.55 | v47,23.55 46.35,22.9 46.35,22.15 v46.55,21.95 | v31.1,23.75 v35.3,23.75 | v21.1,29.75 v22.35,29.75 | v21.55,35 20.9,35 20.9,35.15 U2.20
  Bottom 0.152: v62.85,38.4 v62.85,41.95 | v47,23.55 v50.65,23.55 | v46.55,21.95 44.1,21.95 42.85,23.2 35.85,23.2 v35.3,23.75 | v31.1,23.75 31.1,24.1 25.45,29.75 v22.35,29.75 | v21.1,29.75 20.75,29.75 19.8,30.7 19.8,31.85 20.1,32.15 20.3,32.15 21.55,33.4 v21.55,35
TXLED  (via drill 0.3)
  Top 0.152: v26.45,37.1 26.6,37.25 26.6,37.85 27.15,37.85 D2.C | v21.5,39.45 v22.3,38.65 | v15.3,39.45 15.2,39.55 15.2,40.5 U2.10
  Bottom 0.152: v26.45,37.1 24.3,39.25 22.55,39.25 22.3,39 v22.3,38.65 | v15.3,39.45 v21.5,39.45
USBVCC  (via drill 0.3)
  Top 0.152: v19.3,15.05 19.3,14.1 Q2.3 | v19.3,25.85 19.3,26.2 18.7,26.8 18.7,27.4 18.55,27.55 18.55,29.35 17.2,30.7 17.2,31.45 17.15,31.5 | 17.15,31.5 16.45,31.5 C4.1 16.35,31.5 15.45,31.5 15,31.95 13.6,31.95 C5.A 13.6,31.45 13.6,30.5 13.1,30 4.7,30 4.7,30.45 F2.2 | U2.15 17.7,35.15 17.7,32.8 17.2,32.3 17.2,31.55 17.15,31.5
  Bottom 0.152: v19.3,25.85 v19.3,15.05
VIN  (via drill 0.3)
  Top 0.152: v18.45,7.25 14.5,7.25 D6.C 14.45,7.25 13.5,7.25 v9.9,10.85 | v20.4,7.25 21.6,7.25 21.6,7.7 C17.+ 21.6,7.2 21.6,6.75 v22.55,5.8 | v9.9,23.3 9.6,23.6 8.65,23.6 IC1.3
  Bottom 0.152: v20.4,7.25 v18.45,7.25 | v9.9,10.85 v9.9,23.3 | v22.55,5.8 27.85,0.5 43.3,0.5 45.7,2.9 45.7,3 JP7.8
VUSB  (via drill 0.3)
  Top 0.152: C3.1 1.85,27.7 1.85,29.45 1.9,29.5 1.9,30.45 F2.1 1.9,30.55 1.9,31.45 v2.3,31.85 | v2.3,36 6.5,40.2 7.8,40.2 U$3.VBUS
  Bottom 0.152: v2.3,31.85 v2.3,36

### Text on the board
tPlace: RX / TX / D13 / ON | v1.0/Rev B / 06/15/2014
214bmp: D:/SmartProjects/Snc/a4_bn_logo2.bmp